# EAGLE schematic cerberus (EAGLE 7.5.0)
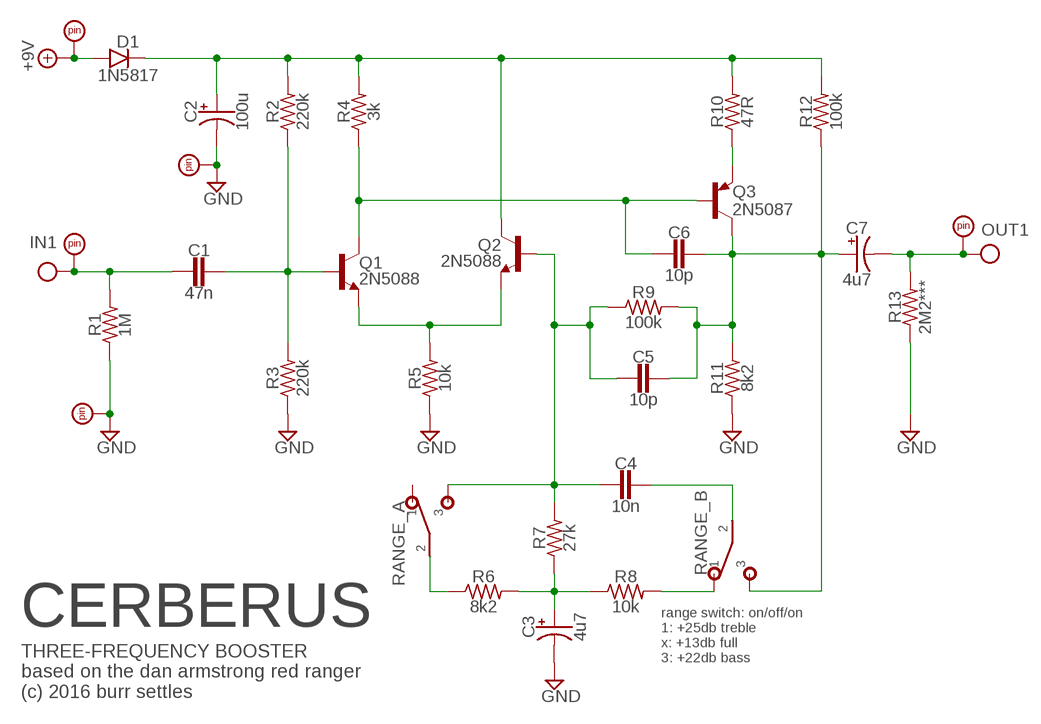
[diagram p0: schematic, sheet 1]

## Parts
C1  47n  CER/FILMBOX.1  [BOX_SMALL]
C2  100u  0501  [050_020_1]
C3  4u7  0501  [050_020_1]
C4  10n  CER/FILMBOX.1  [BOX_SMALL]
C5  10p  CER/FILM2  [050X030_025_2]
C6  10p  CER/FILM2  [050X030_025_2]
C7  4u7  0501  [050_020_1]
D1  1N5817  DO41.2  [DO41-2]
PAD1  PADSQR  [SQUARE]
PAD2  PADSQR  [SQUARE]
PAD3  PADRND  [ROUND]
PAD4  PADRND  [ROUND]
PAD5  PADSQR  [SQUARE]
Q1  2N5088  [TO92-]
Q2  2N5088  [TO92-]
Q3  2N5087  2N5087.1  [TO92-]
R1  1M  R_.3B  [R0207/3]
R2  220k  R_.3B  [R0207/3]
R3  220k  R_.3B  [R0207/3]
R4  3k  R_.3B  [R0207/3]
R5  10k  R_.3B  [R0207/3]
R6  8k2  R_.3B  [R0207/3]
R7  27k  R_.3B  [R0207/3]
R8  10k  R_.3B  [R0207/3]
R9  100k  R_.3B  [R0207/3]
R10  47R  R_.3B  [R0207/3]
R11  8k2  R_.3B  [R0207/3]
R12  100k  R_.3B  [R0207/3]
R13  2M2***  R_.3B  [R0207/3]
RANGE  DPDT  DPDTPADS  [DPDT_PADS]

## Nets
+9V: D1.A PAD1.1
GND: C2.- C3.- PAD3.1 PAD4.1 R1.1 R3.1 R5.1 R11.1 R13.1
IN: C1.2 PAD2.1 R1.2
N$1: C1.1 Q1.2(B) R2.1 R3.2
N$2: Q3.3(E) R10.1
N$4: C6.2 Q1.1(C) Q3.2(B) R4.1
N$5: Q1.3(E) Q2.3(E) R5.2
N$6: C5.1 C6.1 C7.+ Q3.1(C) R9.2 R11.2 R12.1 RANGE.P$6
N$7: C2.+ D1.C Q2.1(C) R2.2 R4.2 R10.2 R12.2
N$8: R6.1 RANGE.P$2
N$9: C4.1 RANGE.P$5
N$10: C4.2 C5.2 Q2.2(B) R7.2 R9.1 RANGE.P$3
N$12: C3.+ R6.2 R7.1 R8.1
N$14: R8.2 RANGE.P$4
OUT: C7.- PAD5.1 R13.2
Unconnected: RANGE.P$1

## Notes on the sheet
- CERBERUS
- range switch: on/off/on
  1: +25db treble
  x: +13db full
  3: +22db bass
- THREE-FREQUENCY BOOSTER
  based on the dan armstrong red ranger
  (c) 2016 burr settles

## Library data of the parts
C1 C4-C6 = capacitors-film:CER/FILM: 47 - 120pF Xicon Ceramic Disc 2.5mm lead spacing
C2 C3 C7 = capacitors-elec:050: 0.22 - 100uF Xicon values at Mouser.com: 10V: 10 - 100uF; 16V: 2.2 - 47uF; 25V: 0.47 - 47uF; 50V: 0.22 - 22uF
D1 = diodes:DO41: DO-41 Package Diodes: 1N4001 - 1N40019 Zener Diodes: 1N4728 - 1N4764
PAD1-PAD5 = supply pins:PAD
Q1 Q2 = transistors:2N5088: NPN Transistor
Q3 = transistors:2N5087: PNP Transistor
R1-R13 = resistors:R_
RANGE = switches:DPDT